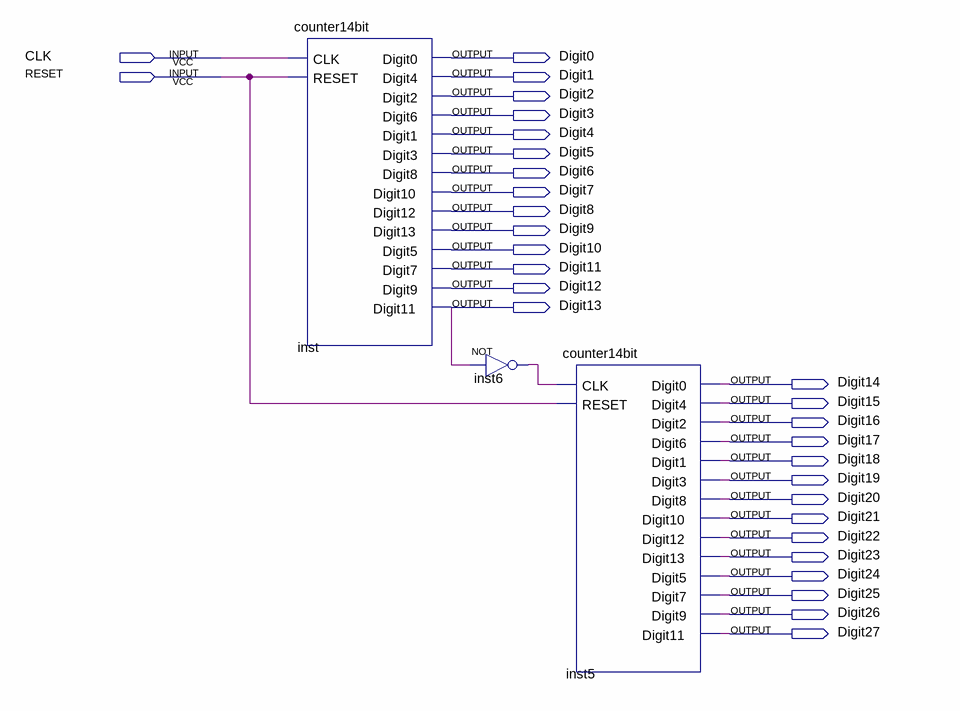
[diagram p0: schematic sheet]
// Quartus schematic counter28bit.bdf as structural Verilog: 3 symbols, 30 pins
module counter28bit (
  input  CLK,
  input  RESET,
  output Digit0,
  output Digit1,
  output Digit2,
  output Digit3,
  output Digit4,
  output Digit5,
  output Digit6,
  output Digit7,
  output Digit8,
  output Digit9,
  output Digit10,
  output Digit11,
  output Digit12,
  output Digit13,
  output Digit14,
  output Digit15,
  output Digit16,
  output Digit17,
  output Digit18,
  output Digit19,
  output Digit20,
  output Digit21,
  output Digit22,
  output Digit23,
  output Digit24,
  output Digit25,
  output Digit26,
  output Digit27
);

  wire inst6_out;

  counter14bit inst (
    .CLK(CLK), .RESET(RESET), .Digit0(Digit0), .Digit4(Digit1), .Digit2(Digit2), .Digit6(Digit3),
    .Digit1(Digit4), .Digit3(Digit5), .Digit8(Digit6), .Digit10(Digit7), .Digit12(Digit8), .Digit13(Digit9),
    .Digit5(Digit10), .Digit7(Digit11), .Digit9(Digit12), .Digit11(Digit13));
  not inst6 (inst6_out, Digit13);
  counter14bit inst5 (
    .CLK(inst6_out), .RESET(RESET), .Digit0(Digit14), .Digit4(Digit15), .Digit2(Digit16), .Digit6(Digit17),
    .Digit1(Digit18), .Digit3(Digit19), .Digit8(Digit20), .Digit10(Digit21), .Digit12(Digit22),
    .Digit13(Digit23), .Digit5(Digit24), .Digit7(Digit25), .Digit9(Digit26), .Digit11(Digit27));
endmodule
